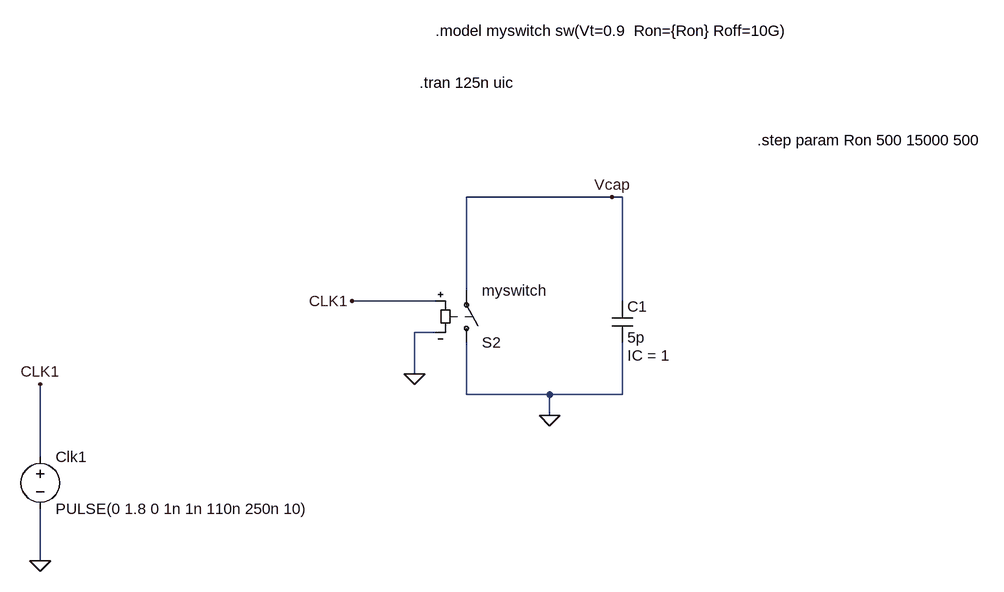
[diagram p0: schematic 5tau.asc]
5tau.asc, the LTspice schematic file:
Version 4
SHEET 1 1176 680
WIRE 560 -32 336 -32
WIRE 576 -32 560 -32
WIRE 336 112 336 -32
WIRE 288 128 160 128
WIRE 576 128 576 -32
WIRE 288 176 256 176
WIRE 256 240 256 176
WIRE 336 272 336 192
WIRE 464 272 336 272
WIRE 576 272 576 192
WIRE 576 272 464 272
WIRE 464 304 464 272
WIRE -320 368 -320 256
WIRE -320 528 -320 448
FLAG 256 240 0
FLAG -320 256 CLK1
FLAG -320 528 0
FLAG 160 128 CLK1
FLAG 560 -32 Vcap
FLAG 464 304 0
SYMBOL sw 336 208 M180
SYMATTR InstName S2
SYMATTR Value myswitch
SYMBOL cap 560 128 R0
WINDOW 123 24 84 Left 2
SYMATTR InstName C1
SYMATTR Value 5p
SYMATTR Value2 IC = 1
SYMBOL voltage -320 352 R0
WINDOW 123 0 0 Left 0
WINDOW 39 0 0 Left 0
SYMATTR InstName Clk1
SYMATTR Value PULSE(0 1.8 0 1n 1n 110n 250n 10)
TEXT 288 -288 Left 2 !.model myswitch sw(Vt=0.9  Ron={Ron} Roff=10G)
TEXT 264 -208 Left 2 !.tran 125n uic
TEXT 784 -120 Left 2 !.step param Ron 500 15000 500

The netlist it stands for:
* 5tau.asc
S2 0 Vcap CLK1 0 myswitch
C1 Vcap 0 5p IC = 1
V§Clk1 CLK1 0 PULSE(0 1.8 0 1n 1n 110n 250n 10)
.model myswitch sw(Vt=0.9  Ron={Ron} Roff=10G)
.tran 125n uic
.step param Ron 500 15000 500
.backanno
.end